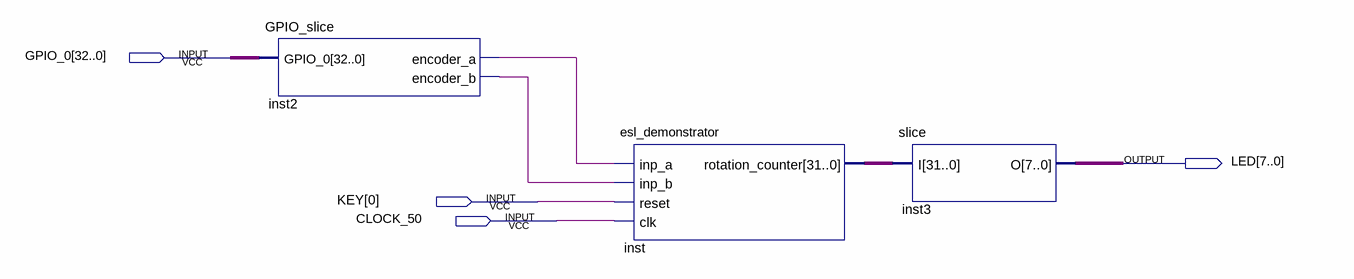
[diagram p0: schematic sheet]
// Quartus schematic Block1.bdf as structural Verilog: 3 symbols, 4 pins
module Block1 (
  input  [32:0] GPIO_0,
  input  [0:0] KEY,
  input  CLOCK_50,
  output [7:0] LED
);

  wire inst2_encoder_a, inst2_encoder_b;
  wire [31:0] inst_rotation_counter;

  GPIO_slice inst2 (.GPIO_0(GPIO_0), .encoder_a(inst2_encoder_a), .encoder_b(inst2_encoder_b));
  esl_demonstrator inst (
    .inp_a(inst2_encoder_a), .inp_b(inst2_encoder_b), .reset(KEY[0]), .clk(CLOCK_50),
    .rotation_counter(inst_rotation_counter));
  slice inst3 (.I(inst_rotation_counter), .O(LED));
endmodule
